# Altium schematic sheet VL53L0X.SchDoc
size A4
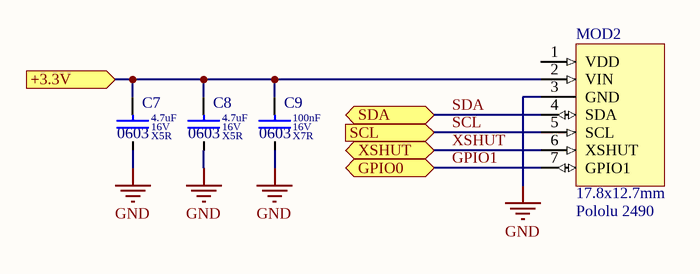
[diagram p0: VL53L0X.SchDoc]

## Parts
C7  value 4.7uF  Dielectric: X5R  Voltage: 16V  SCH_Footprint: 0603  [C_0603_1608]  (hidden comment: Ceramic X5R)
C8  value 4.7uF  Dielectric: X5R  Voltage: 16V  SCH_Footprint: 0603  [C_0603_1608]  (hidden comment: Ceramic X5R)
C9  value 100nF  Dielectric: X7R  Voltage: 16V  SCH_Footprint: 0603  [C_0603_1608]  (hidden comment: Ceramic X7R)
MOD2  value Pololu 2490  SCH_Footprint: 17.8x12.7mm  [MOD_VL53L0X]  (hidden comment: time-of-flight)

## Ports
+3.3V (in), GPIO0 (bidir), SCL (in), SDA (bidir), XSHUT (bidir)

## Nets
GND: C7.2 C8.2 C9.2 MOD2.3(GND)
+3.3V: C7.1 C8.1 C9.1 MOD2.2(VIN) ; port +3.3V
GPIO1: MOD2.7(GPIO1) ; port GPIO0
SCL: MOD2.5(SCL) ; port SCL
SDA: MOD2.4(SDA) ; port SDA
XSHUT: MOD2.6(XSHUT) ; port XSHUT

Not connected (* = marked no-connect by the designer): MOD2 1(VDD)

## Library data of the parts
C7 C8 = C_4.7uF_16V_X5R_0603_10: Capacitor; Manufacturer: Murata; Manufacturer Part Number: GRM188R61C475KAAJD; Tolerance (%): 10; Part Number: C_4.7uF_16V_X5R_0603_10; HelpURL: https://datasheet.octopart.com/GRM188R61C475KAAJD-Murata-datasheet-66077093.pdf; Supplier 1: TME; Supplier 2: RS Components; Supplier Part Number 2: 884-7264P; Supplier 3: Farnell; Supplier Part Number 3: 2611924; Supplier 4: Mouser; Supplier Part Number 4: 81-GRM188R61C475KAJD; Supplier 5: Digi-Key; Supplier Part Number 5: 490-10481-2-ND; Supplier 6: LCSC
C9 = C_100nF_16V_X7R_0603_10: Capacitor; Manufacturer: Kemet; Manufacturer Part Number: C0603C104K4RAC7013; Tolerance (%): 10; Part Number: C_100nF_16V_X7R_0603_10; HelpURL: https://pl.mouser.com/datasheet/2/212/KEM_C1002_X7R_SMD-1102033.pdf; Supplier 1: TME; Supplier 2: RS Components; Supplier 3: Farnell; Supplier 4: Mouser; Supplier Part Number 4: 80-C0603C104K4RC7013; Supplier 5: Digi-Key; Supplier Part Number 5: 399-7372-2-ND; Supplier 6: LCSC
MOD2 = MOD_VL53L0X: Pin Header; Manufacturer: Polulu; Part Number: MOD_VL53L0X; HelpURL: https://www.pololu.com/file/download/VL53L0X.pdf?file_id=0J1187; Manufacturer Part Number: Pololu 2490; Supplier 1: TME; Supplier 2: RS Components; Supplier 3: Farnell; Supplier 4: Mouser; Supplier 5: Digi-Key; Supplier 6: LCSC; Supplier 7: Botland; Supplier Part Number 7: PLL-07176